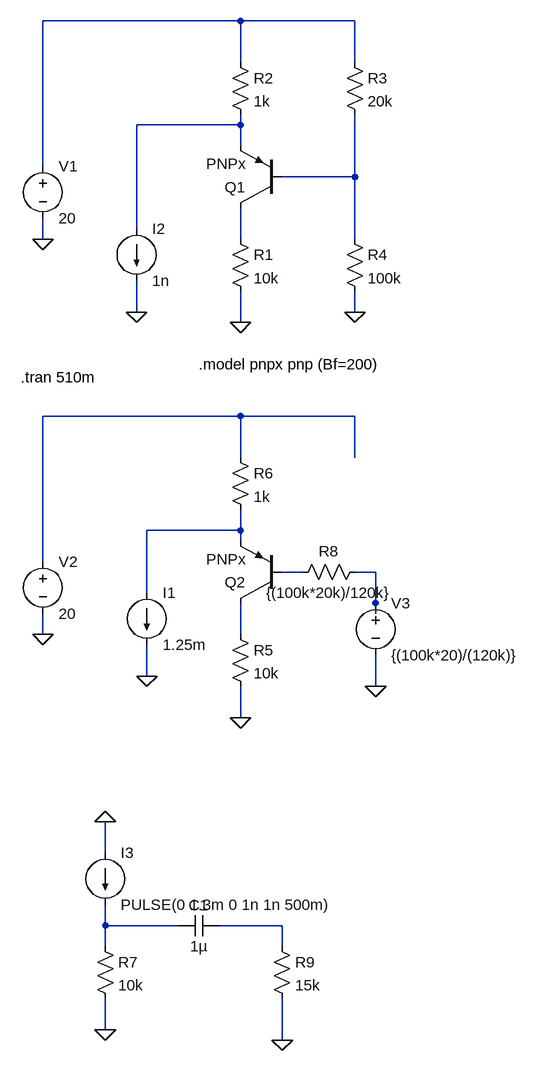
[diagram p0: schematic 2012_ampl.asc]
2012_ampl.asc, the LTspice schematic file:
Version 4
SHEET 1 880 1508
WIRE 176 -80 -128 -80
WIRE 352 -80 176 -80
WIRE 176 -16 176 -80
WIRE 352 -16 352 -80
WIRE 176 80 176 64
WIRE 176 80 16 80
WIRE 176 112 176 80
WIRE -128 144 -128 -80
WIRE 352 160 352 64
WIRE 352 160 240 160
WIRE 16 240 16 80
WIRE -128 256 -128 224
WIRE 176 256 176 208
WIRE 352 256 352 160
WIRE 16 368 16 320
WIRE 352 368 352 336
WIRE 176 384 176 336
WIRE 176 528 -128 528
WIRE 352 528 176 528
WIRE 176 592 176 528
WIRE 352 592 352 528
WIRE 176 704 176 672
WIRE 176 704 32 704
WIRE 176 720 176 704
WIRE -128 752 -128 528
WIRE 272 768 240 768
WIRE 384 768 352 768
WIRE 32 800 32 704
WIRE 384 816 384 768
WIRE 384 832 384 816
WIRE -128 864 -128 832
WIRE 176 864 176 816
WIRE 32 928 32 880
WIRE 384 944 384 896
WIRE 176 992 176 944
WIRE -32 1200 -32 1152
WIRE -32 1312 -32 1280
WIRE 80 1312 -32 1312
WIRE 240 1312 144 1312
WIRE -32 1344 -32 1312
WIRE 240 1344 240 1312
WIRE -32 1472 -32 1424
WIRE 240 1488 240 1424
FLAG -128 256 0
FLAG 352 368 0
FLAG 176 384 0
FLAG -128 864 0
FLAG 384 944 0
FLAG 176 992 0
FLAG 32 928 0
FLAG 16 368 0
FLAG -32 1472 0
FLAG 240 1488 0
FLAG -32 1152 0
SYMBOL pnp 240 208 R180
SYMATTR InstName Q1
SYMATTR Value PNPx
SYMBOL voltage -128 128 R0
WINDOW 123 0 0 Left 2
WINDOW 39 0 0 Left 2
SYMATTR InstName V1
SYMATTR Value 20
SYMBOL res 160 240 R0
SYMATTR InstName R1
SYMATTR Value 10k
SYMBOL res 160 -32 R0
SYMATTR InstName R2
SYMATTR Value 1k
SYMBOL res 336 -32 R0
SYMATTR InstName R3
SYMATTR Value 20k
SYMBOL res 336 240 R0
SYMATTR InstName R4
SYMATTR Value 100k
SYMBOL pnp 240 816 R180
SYMATTR InstName Q2
SYMATTR Value PNPx
SYMBOL voltage -128 736 R0
WINDOW 123 0 0 Left 2
WINDOW 39 0 0 Left 2
SYMATTR InstName V2
SYMATTR Value 20
SYMBOL res 160 848 R0
SYMATTR InstName R5
SYMATTR Value 10k
SYMBOL res 160 576 R0
SYMATTR InstName R6
SYMATTR Value 1k
SYMBOL res 368 752 R90
WINDOW 0 0 56 VBottom 2
WINDOW 3 32 56 VTop 2
SYMATTR InstName R8
SYMATTR Value {(100k*20k)/120k}
SYMBOL voltage 384 800 R0
WINDOW 123 0 0 Left 2
WINDOW 39 0 0 Left 2
SYMATTR InstName V3
SYMATTR Value {(100k*20)/(120k)}
SYMBOL current 32 800 R0
WINDOW 123 0 0 Left 2
WINDOW 39 0 0 Left 2
SYMATTR InstName I1
SYMATTR Value 1.25m
SYMBOL current 16 240 R0
WINDOW 123 0 0 Left 2
WINDOW 39 0 0 Left 2
SYMATTR InstName I2
SYMATTR Value 1n
SYMBOL res -48 1328 R0
SYMATTR InstName R7
SYMATTR Value 10k
SYMBOL res 224 1328 R0
SYMATTR InstName R9
SYMATTR Value 15k
SYMBOL cap 144 1296 R90
WINDOW 0 0 32 VBottom 2
WINDOW 3 32 32 VTop 2
SYMATTR InstName C1
SYMATTR Value 1µ
SYMBOL current -32 1200 R0
WINDOW 123 0 0 Left 2
WINDOW 39 0 0 Left 2
SYMATTR InstName I3
SYMATTR Value PULSE(0 1.3m 0 1n 1n 500m)
TEXT 112 448 Left 2 !.model pnpx pnp (Bf=200)
TEXT -162 468 Left 2 !.tran 510m

The netlist it stands for:
* 2012_ampl.asc
Q1 N004 N003 N002 0 PNPx
V1 N001 0 20
R1 N004 0 10k
R2 N001 N002 1k
R3 N001 N003 20k
R4 N003 0 100k
Q2 N009 N007 N006 0 PNPx
V2 N005 0 20
R5 N009 0 10k
R6 N005 N006 1k
R8 N008 N007 {(100k*20k)/120k}
V3 N008 0 {(100k*20)/(120k)}
I1 N006 0 1.25m
I2 N002 0 1n
R7 N010 0 10k
R9 N011 0 15k
C1 N011 N010 1µ
I3 0 N010 PULSE(0 1.3m 0 1n 1n 500m)
.model NPN NPN
.model PNP PNP
.lib standard.bjt
.model pnpx pnp (Bf=200)
.tran 510m
.backanno
.end